# EAGLE design Adafruit 3.5in 480x320 FeatherWing Capacitive (EAGLE 9.6.2)
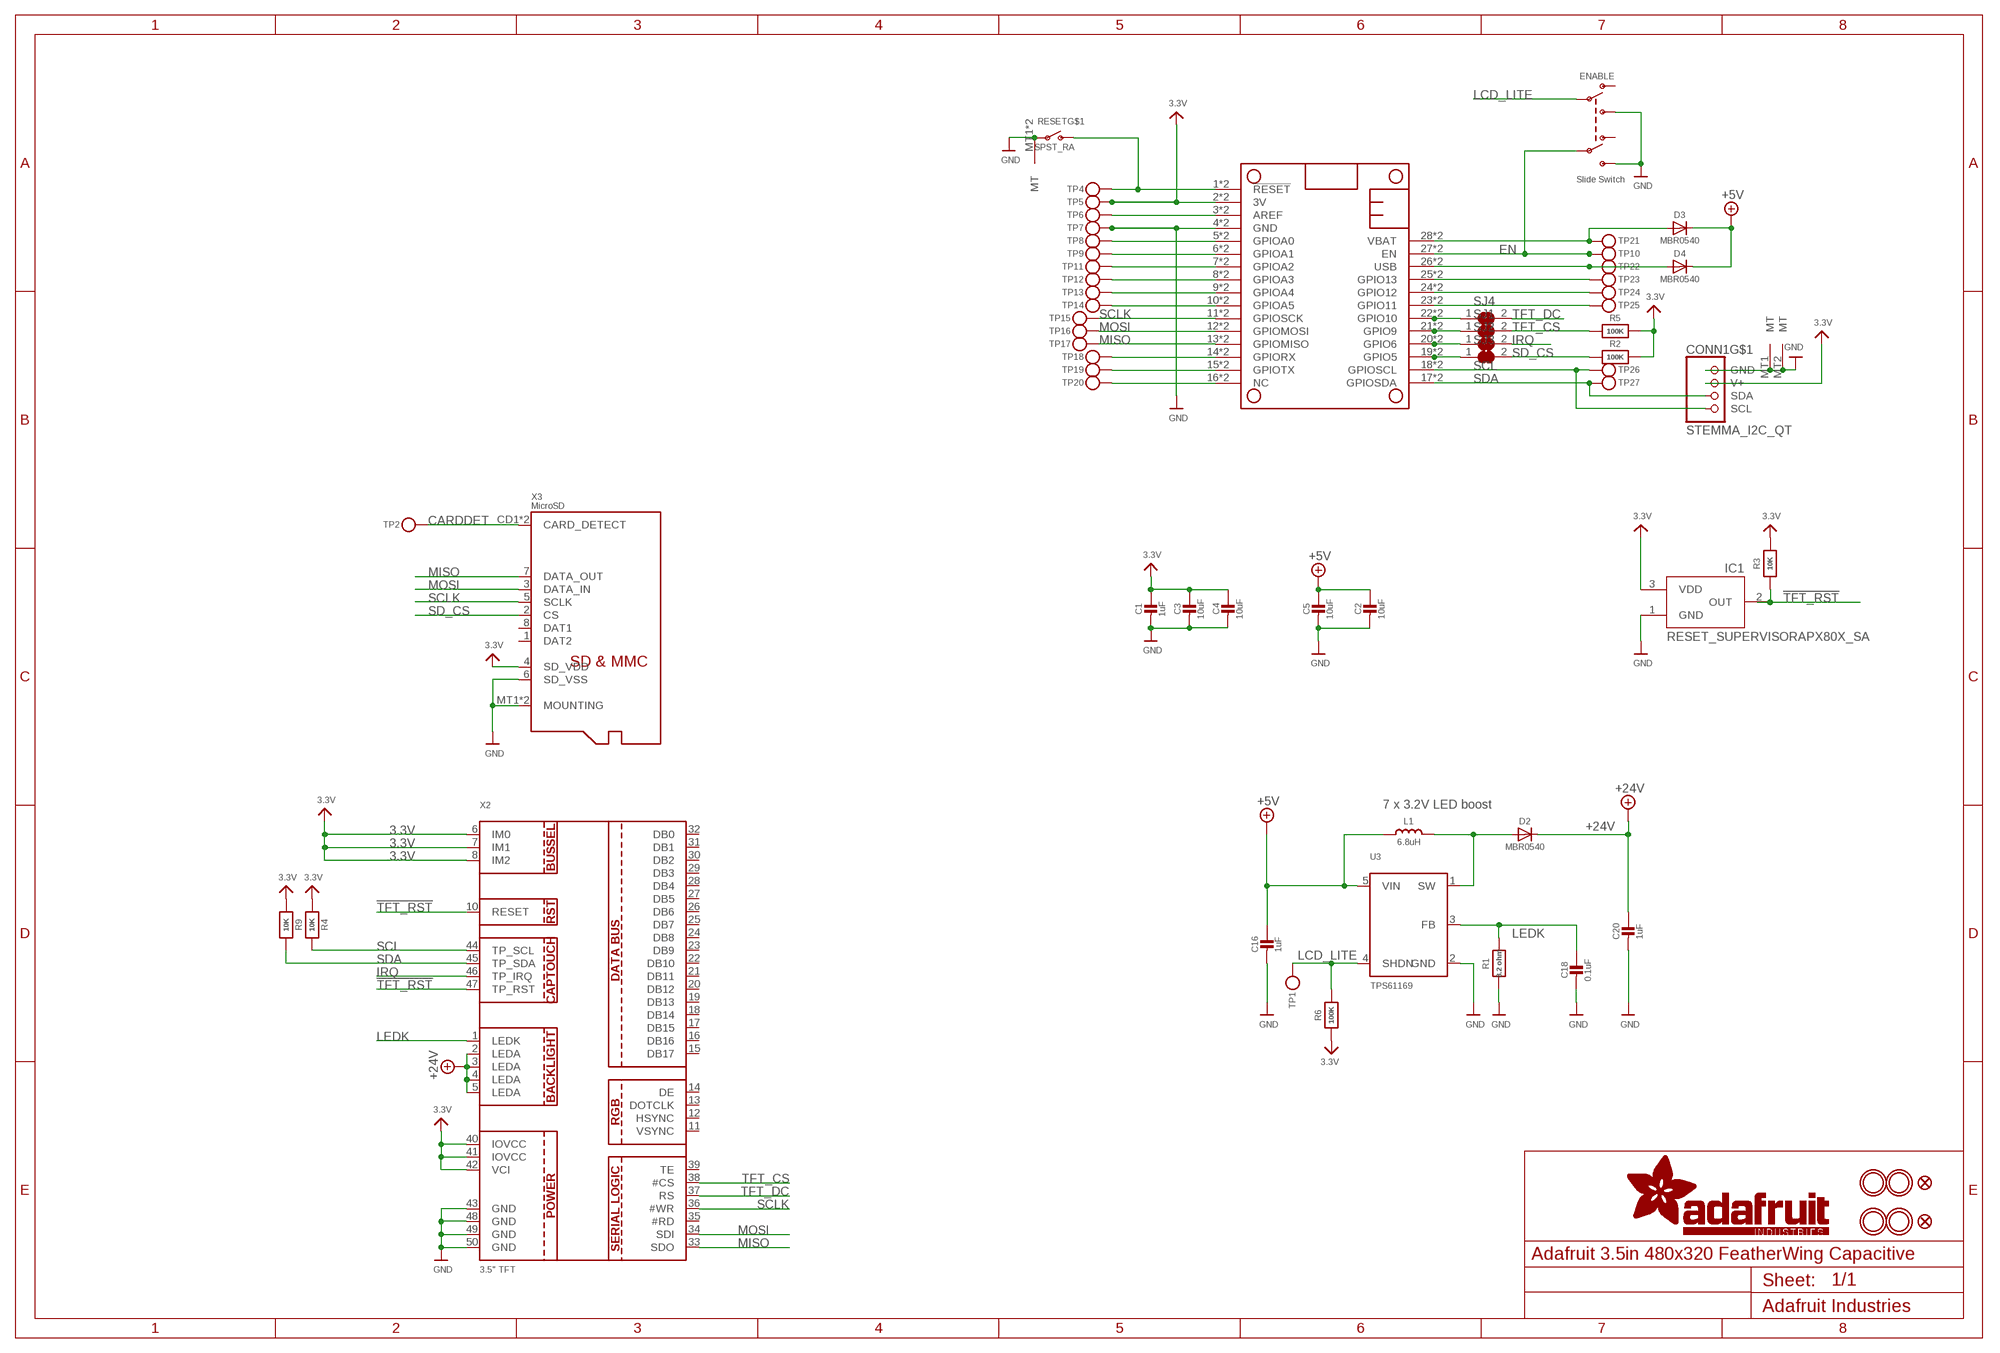
[diagram p0: schematic, sheet 1]

## Parts
C1  1uF  CAP_CERAMIC0805-NOOUTLINE  [0805-NO]
C2  10uF  CAP_CERAMIC0805-NOOUTLINE  [0805-NO]
C3  10uF  CAP_CERAMIC0805-NOOUTLINE  [0805-NO]
C4  10uF  CAP_CERAMIC0805-NOOUTLINE  [0805-NO]
C5  10uF  CAP_CERAMIC0805-NOOUTLINE  [0805-NO]
C16  1uF  CAP_CERAMIC0805-NOOUTLINE  [0805-NO]
C18  0.1uF  CAP_CERAMIC0603_NO  [0603-NO]
C20  1uF  CAP_CERAMIC0805-NOOUTLINE  [0805-NO]
CONN1  STEMMA_I2C_QT  [JST_SH4]
D2  MBR0540  DIODESOD-123  [SOD-123]
D3  MBR0540  DIODESOD-123  [SOD-123]
D4  MBR0540  DIODESOD-123  [SOD-123]
ENABLE  Slide Switch  SWITCH_DPDTEG1390  [EG1390]
IC1  RESET_SUPERVISORAPX80X_SA  [SOT23-WIDE]
L1  6.8uH  INDUCTORNR5040  [INDUCTOR_5X5MM_NR5040_NOTHERMALS]
MS2  FEATHERWING_SMTDUAL  [FEATHERWING_SMT2]
R1  8.2 ohm  RESISTOR_0603_NOOUT  [0603-NO]
R2  100K  RESISTOR_0603_NOOUT  [0603-NO]
R3  10K  RESISTOR_0603_NOOUT  [0603-NO]
R4  10K  RESISTOR_0603_NOOUT  [0603-NO]
R5  100K  RESISTOR_0603_NOOUT  [0603-NO]
R6  100K  RESISTOR_0603_NOOUT  [0603-NO]
R9  10K  RESISTOR_0603_NOOUT  [0603-NO]
RESET  SPST_RA  SWITCH_SPST_MNT_TACT_RA  [SPST_TACTILE_RA]
SJ1  SOLDERJUMPER_CLOSED  [SOLDERJUMPER_CLOSEDWIRE]
SJ2  SOLDERJUMPER_CLOSED  [SOLDERJUMPER_CLOSEDWIRE]
SJ3  SOLDERJUMPER_CLOSED  [SOLDERJUMPER_CLOSEDWIRE]
SJ4  SOLDERJUMPER_CLOSED  [SOLDERJUMPER_CLOSEDWIRE]
TP1  TESTPOINTPAD2MM  [TESTPOINT_PAD_2MM]
TP2  TESTPOINTPAD2MM  [TESTPOINT_PAD_2MM]
TP4  TESTPOINTPAD2MM  [TESTPOINT_PAD_2MM]
TP5  TESTPOINTPAD2MM  [TESTPOINT_PAD_2MM]
TP6  TESTPOINTPAD2MM  [TESTPOINT_PAD_2MM]
TP7  TESTPOINTPAD2MM  [TESTPOINT_PAD_2MM]
TP8  TESTPOINTPAD2MM  [TESTPOINT_PAD_2MM]
TP9  TESTPOINTPAD2MM  [TESTPOINT_PAD_2MM]
TP10  TESTPOINTPAD2MM  [TESTPOINT_PAD_2MM]
TP11  TESTPOINTPAD2MM  [TESTPOINT_PAD_2MM]
TP12  TESTPOINTPAD2MM  [TESTPOINT_PAD_2MM]
TP13  TESTPOINTPAD2MM  [TESTPOINT_PAD_2MM]
TP14  TESTPOINTPAD2MM  [TESTPOINT_PAD_2MM]
TP15  TESTPOINTPAD2MM  [TESTPOINT_PAD_2MM]
TP16  TESTPOINTPAD2MM  [TESTPOINT_PAD_2MM]
TP17  TESTPOINTPAD2MM  [TESTPOINT_PAD_2MM]
TP18  TESTPOINTPAD2MM  [TESTPOINT_PAD_2MM]
TP19  TESTPOINTPAD2MM  [TESTPOINT_PAD_2MM]
TP20  TESTPOINTPAD2MM  [TESTPOINT_PAD_2MM]
TP21  TESTPOINTPAD2MM  [TESTPOINT_PAD_2MM]
TP22  TESTPOINTPAD2MM  [TESTPOINT_PAD_2MM]
TP23  TESTPOINTPAD2MM  [TESTPOINT_PAD_2MM]
TP24  TESTPOINTPAD2MM  [TESTPOINT_PAD_2MM]
TP25  TESTPOINTPAD2MM  [TESTPOINT_PAD_2MM]
TP26  TESTPOINTPAD2MM  [TESTPOINT_PAD_2MM]
TP27  TESTPOINTPAD2MM  [TESTPOINT_PAD_2MM]
U3  TPS61169  VREG_BOOST_5PIN_SC70  [SC70-5]
U$7  MOUNTINGHOLE3.0THIN  [MOUNTINGHOLE_3.0_PLATEDTHIN]
U$9  FIDUCIAL_1MM  [FIDUCIAL_1MM]
U$15  MOUNTINGHOLE3.0THIN  [MOUNTINGHOLE_3.0_PLATEDTHIN]
U$16  MOUNTINGHOLE3.0THIN  [MOUNTINGHOLE_3.0_PLATEDTHIN]
U$17  MOUNTINGHOLE3.0THIN  [MOUNTINGHOLE_3.0_PLATEDTHIN]
U$23  FIDUCIAL_1MM  [FIDUCIAL_1MM]
X2  3.5" TFT  DISP_LCD_3.5IN_320X480CTP_50PIN  [TFT_3.5IN_320X480_50PIN]
X3  MicroSD  MICROSD  [MICROSD]

## Nets
3.3V: C1.1 C3.1 C4.1 CONN1.2(V+) IC1.3(VDD) MS2.2'(3V) MS2.2(3V) R2.2 R3.2 R4.1 R5.2 R6.1 R9.1 TP5.P$1 X2.6(IM0) X2.7(IM1) X2.8(IM2) X2.40(IOVCC) X2.41(IOVCC) X2.42(VCI) X3.4(SD_VDD)
!RESET: MS2.1'(!RESET) MS2.1(!RESET) RESET.2(S) TP4.P$1
!TFT_RST: IC1.2(OUT) R3.1 X2.10(RESET) X2.47(TP_RST)
+5V: C2.1 C5.1 C16.1 D3.C D4.C L1.P$1 U3.5(VIN)
+24V: C20.1 D2.C X2.2(LEDA) X2.3(LEDA) X2.4(LEDA) X2.5(LEDA)
A: MS2.5'(GPIOA0) MS2.5(GPIOA0) TP8.P$1
AREF: MS2.3'(AREF) MS2.3(AREF) TP6.P$1
B: MS2.6'(GPIOA1) MS2.6(GPIOA1) TP9.P$1
C: MS2.7'(GPIOA2) MS2.7(GPIOA2) TP11.P$1
CARDDET: TP2.P$1 X3.CD1(CARD_DETECT) X3.CD2(CARD_DETECT)
D: MS2.8'(GPIOA3) MS2.8(GPIOA3) TP12.P$1
E: MS2.9'(GPIOA4) MS2.9(GPIOA4) TP13.P$1
EN: ENABLE.P2 MS2.27'(EN) MS2.27(EN) TP10.P$1
F: MS2.10'(GPIOA5) MS2.10(GPIOA5) TP14.P$1
G: MS2.16'(NC) MS2.16(NC) TP20.P$1
GND: C1.2 C2.2 C3.2 C4.2 C5.2 C16.2 C18.2 C20.2 CONN1.1(GND) CONN1.MT1(MT) CONN1.MT2(MT) ENABLE.S1 ENABLE.S2 IC1.1(GND) MS2.4'(GND) MS2.4(GND) R1.1 RESET.1(P) RESET.MT1(MT) RESET.MT2(MT) TP7.P$1 U3.2(GND) X2.43(GND) X2.48(GND) X2.49(GND) X2.50(GND) X3.6(SD_VSS) X3.MT1(MOUNTING) X3.MT2(MOUNTING)
H: MS2.19'(GPIO5) MS2.19(GPIO5) SJ3.1
I: MS2.20'(GPIO6) MS2.20(GPIO6) SJ2.1
IRQ: SJ2.2 X2.46(TP_IRQ)
J: MS2.21'(GPIO9) MS2.21(GPIO9) SJ1.1
K: MS2.22'(GPIO10) MS2.22(GPIO10) SJ4.1
L: MS2.23'(GPIO11) MS2.23(GPIO11) TP25.P$1
LCD_LITE: ENABLE.P1 R6.2 TP1.P$1 U3.4(SHDN)
LEDK: C18.1 R1.2 U3.3(FB) X2.1(LEDK)
M: MS2.24'(GPIO12) MS2.24(GPIO12) TP24.P$1
MISO: MS2.13'(GPIOMISO) MS2.13(GPIOMISO) TP17.P$1 X2.33(SDO) X3.7(DATA_OUT)
MOSI: MS2.12'(GPIOMOSI) MS2.12(GPIOMOSI) TP16.P$1 X2.34(SDI) X3.3(DATA_IN)
N: MS2.25'(GPIO13) MS2.25(GPIO13) TP23.P$1
N$3: D2.A L1.P$2 U3.1(SW)
RX: MS2.14'(GPIORX) MS2.14(GPIORX) TP18.P$1
SCL: CONN1.4(SCL) MS2.18'(GPIOSCL) MS2.18(GPIOSCL) R4.2 TP26.P$1 X2.44(TP_SCL)
SCLK: MS2.11'(GPIOSCK) MS2.11(GPIOSCK) TP15.P$1 X2.36(#WR) X3.5(SCLK)
SD_CS: R2.1 SJ3.2 X3.2(CS)
SDA: CONN1.3(SDA) MS2.17'(GPIOSDA) MS2.17(GPIOSDA) R9.2 TP27.P$1 X2.45(TP_SDA)
TFT_CS: R5.1 SJ1.2 X2.38(#CS)
TFT_DC: SJ4.2 X2.37(RS)
TX: MS2.15'(GPIOTX) MS2.15(GPIOTX) TP19.P$1
USB: D4.A MS2.26'(USB) MS2.26(USB) TP22.P$1
VBAT: D3.A MS2.28'(VBAT) MS2.28(VBAT) TP21.P$1
Unconnected: ENABLE.O1 ENABLE.O2 X2.11(VSYNC) X2.12(HSYNC) X2.13(DOTCLK) X2.14(DE) X2.15(DB17) X2.16(DB16) X2.17(DB15) X2.18(DB14) X2.19(DB13) X2.20(DB12) X2.21(DB11) X2.22(DB10) X2.23(DB9) X2.24(DB8) X2.25(DB7) X2.26(DB6) X2.27(DB5) X2.28(DB4) X2.29(DB3) X2.30(DB2) X2.31(DB1) X2.32(DB0) X2.35(#RD) X2.39(TE) X3.1(DAT2) X3.8(DAT1)

## Notes on the sheet
- 7 x 3.2V LED boost

## Library data of the parts
C1-C5 C16 C18 C20 = microbuilder:CAP_CERAMIC: Ceramic Capacitors For new designs, use the packages preceded by an '_' character since they are more reliable: The following footprints should be used on most boards: _0402 - Standard footprint for regular board layouts _0603 - Standard footprint for regular board layouts _0805 - Standard footprint for regular board layouts _1206 - Standard footprint for regular board layouts For extremely tight-pitch boards where space is at a premium, the following 'micro-pitch' footprints can be used (smaller pads, no silkscreen outline, etc.): _0402MP - Micro-pitch footprint for very dense/compact boards _0603MP - Micro-pitch footprint for very dense/compact boards _0805MP - Micro-pitch footprint for very dense/compact boards _1206MP - Micro-pitch footprint for very dense/compact boards
CONN1 = adafruit_electromech:STEMMA_I2C; LCSC: C2845363
D2-D4 = microbuilder:DIODE: Diode SMA Model Volts Amps Type Vf Ir Digikey # Notes SSA34-E3 40V 3A Schottky 480mV @ 3A 200uA @ 40V SSA34-E3/61TGITR-ND CDBA120-G 20V 1A Schottky 500mV @ 1A 500uA @ 20V 641-1014-6-ND REEL MBRA210 10V 2A Schottky 350mV @ 2A 700uA @ 10V MBRA210LT3 SOD-123 Model Volts Amps Type Vf Ir Order # Notes BAT54T1G 30V 200mA Schottky 800mV @ 200mA 2uA @ 25V BAT54T1GOSTR-ND B0530W 30V 500mA Schottky 430mV @ 500mA 130uA @ 30V B0530W-FDICT-ND REEL MBR120 20V 1A Schottky 340mV @ 1A MBR120VLSFT1GOSCT-ND SOD-323 Model Volts Amps Type Vf Ir Order # Notes PMEG2005EJ 20V 500mA Schottky 355mV @ 500mA 568-4110-1-ND ZLLS410 10V 570mA Schottky 380mV @ 570mA ZLLS410CT-ND 1N4148WS 75V 150mA Silicon/Simple 1V 1N4148WSFSCT-ND REEL SOD-523 Model Volts Amps Type Vf Ir Order # Notes BAT54XV2 30V 200mA Schottky 0.8V @ 100mA BAT54XV2CT-ND TB751S 30V 30mA Schottky RB751S-40TE61CT-ND SOT23-R/W (R = Solder Paste/Reflow Ovens, W = Hand-Soldering) Model Volts Amps Type Vf Ir Order # Notes BAT54FILM 40V 300mA Schottky 497-7162-1-ND POWERDI-5 Model Volts Amps Type Vf Ir Order # Notes PDS560 60V 5A Schottky 670mV @ 5A 150uA @ 60V PDS560DICT-ND
ENABLE = adafruit_electromech:SWITCH_DPDT: Switch - DPDT A DPDT Switch acts like an SPDT switch, but has a pair of switches instead of just one. Vertical - 0.3A @ 6V SMT - Digikey: JS202011SCQN; LCSC: C2837066
IC1 = adafruit_power:RESET_SUPERVISOR; ROT: 270
L1 = microbuilder:INDUCTOR: Inductors 0603: 10nH Ceramic Inductor - microwire antenna/RF (Digikey: 712-1434-2-ND) 0805: 560nH Ceramic Inductor - RF (Digikey: 553-1047-1-ND) 270nH Ceramic Inductor - Q = 40@250MHz, +-5%, 1 Ohm DC Resistance (Digikey: 535-10506-2-ND) 1007 (2518 Metric) SMT: 10µH 10% 250mOhm 820mA 1007 Inductor (Digikey: 587-2189-1-ND) 22µH 10% 500mOhm 580mA 1007 Inductor (Digikey: 587-2190-1-ND) 47µH 10% 950mOhm 420mA 1007 Inductor (Digikey: 587-2191-1-ND) 47µH 5% 100mOhm 1A 1008 Inductor (Digikey: 732-1816-1-ND) 5.0x5.0mm (Taiyo Yuden NR5040 Series) 6.8µH 20% 2.3A 64mOhm Inductor (Digikey: 587-2374-2-ND) 5.0x5.0mm (TDK VLC5045 Series) 4.7µH 20% 3.3A 34mOhm Inductor (Digikey: 445-6526-1-ND) 6.8µH 20% 2.7A 46mOhm Inductor (Digikey: 445-6527-1-ND) 6.0x6.0mm (TDK VLC6045 Series) 4.7µH 20% 3.8A 27mOhm Inductor (Digikey: 445-6538-2-ND) 6.8µH 20% 3A 41mOhm Inductor (Digikey: 445-6540-1-ND) 6.2µH 30% 2.2A 45mOhm Inductor (Digikey: SRR5028-6R2YCT-ND) - Not TDK VLC6045 but footprint should match 6.0x6.0mm (TDK SLF6045 Series) 6.8uH 30% 2A 33mOhm Inductor (Digikey: 445-4572-1-ND, Mouser: 810-SLF645T6R8N2R0PF) 6.0x6.0mm (Sumida CDRH5D28 Series) 6.2uH 30% 1.8A 45mOhm Inductor (Digikey: 308-1542-1-ND) Taiyo Yuden NR3015T2R2M - 2.2uH 20% 1.5A (Digikey: 587-1648-2-ND, Mouser: 963-NR3015T2R2M) - Used with TI TPS62172 CoilCraft RFID Transponder Coil - MA5532-AE (For use with AS3935 Lightning Sensor) Taiyo Yuden NRH2412T2R2MNGH - 2.2uH 20% 1AA (Digikey: 587-3443-1-ND) - Used with TI LM3671 Vishay IHLP 1.0uH Molded Inductor - 24mOhm DCR, 5A, +/-20%, -55°C-125°C (Digikey: 541-1319-1-ND)
MS2 = microbuilder:FEATHERWING
R1-R6 R9 = microbuilder:RESISTOR: Resistors For new designs, use the packages preceded by an '_' character since they are more reliable: The following footprints should be used on most boards: _0402 - Standard footprint for regular board layouts _0603 - Standard footprint for regular board layouts _0805 - Standard footprint for regular board layouts _1206 - Standard footprint for regular board layouts For extremely tight-pitch boards where space is at a premium, the following 'micro-pitch' footprints can be used (smaller pads, no silkscreen outline, etc.): _0402MP - Micro-pitch footprint for very dense/compact boards _0603MP - Micro-pitch footprint for very dense/compact boards _0805MP - Micro-pitch footprint for very dense/compact boards _1206MP - Micro-pitch footprint for very dense/compact boards
RESET = adafruit_electromech:SWITCH_SPST_MNT: Switch - SPST 4UCon 19192 (6.7x2.6mm SMT); LCSC: C778159
SJ1-SJ4 = microbuilder:SOLDERJUMPER_CLOSED: Solder Jumper - Closed These solder jumpers are closed by default CLOSEDWIRE - 10 mil trace between pads that can be cut and resoldered later CLOSEDPERM - 63 mil trace between pads for a permanent connection (used to 'bridge' two signals, a shameless hack for Eagle). Can double as a test point as well (no cream layer)
TP1 TP2 TP4-TP27 = microbuilder:TESTPOINT: Test Point Various test points for characterisation and PCB testing TESTPOINT_SMT - Compact Surface Mount Test Point [Digikey: 5016KTR-ND]
U3 = adafruit_power:VREG_BOOST_5PIN: FAN5331 - LED/OLED 20V Boost Converter Digikey: FAN5331SXCT-ND
U$7 U$15-U$17 = adafruit_electromech:MOUNTINGHOLE: Mounting Hole For #2 screws (0.086"/2.18mm width, 0.094"/2.4mm hole) use 2.5mm; BOM: EXCLUDE
U$9 U$23 = microbuilder:FIDUCIAL: Fiducial Alignment Points Various fiducial points for machine vision alignment.; BOM: EXCLUDE
X2 = adafruit_display:DISP_LCD_3.5IN_320X480CTP_50PIN
X3 = adafruit_electromech:MICROSD: MicroSD/Transflash Card Holder with SPI pinout 3M: 2908-05WB-MG 4UConnector: 19656 Footprint courtesy: Adafruit Industries; JLC_ROTATION: 90; LCSC: C125617

## Board
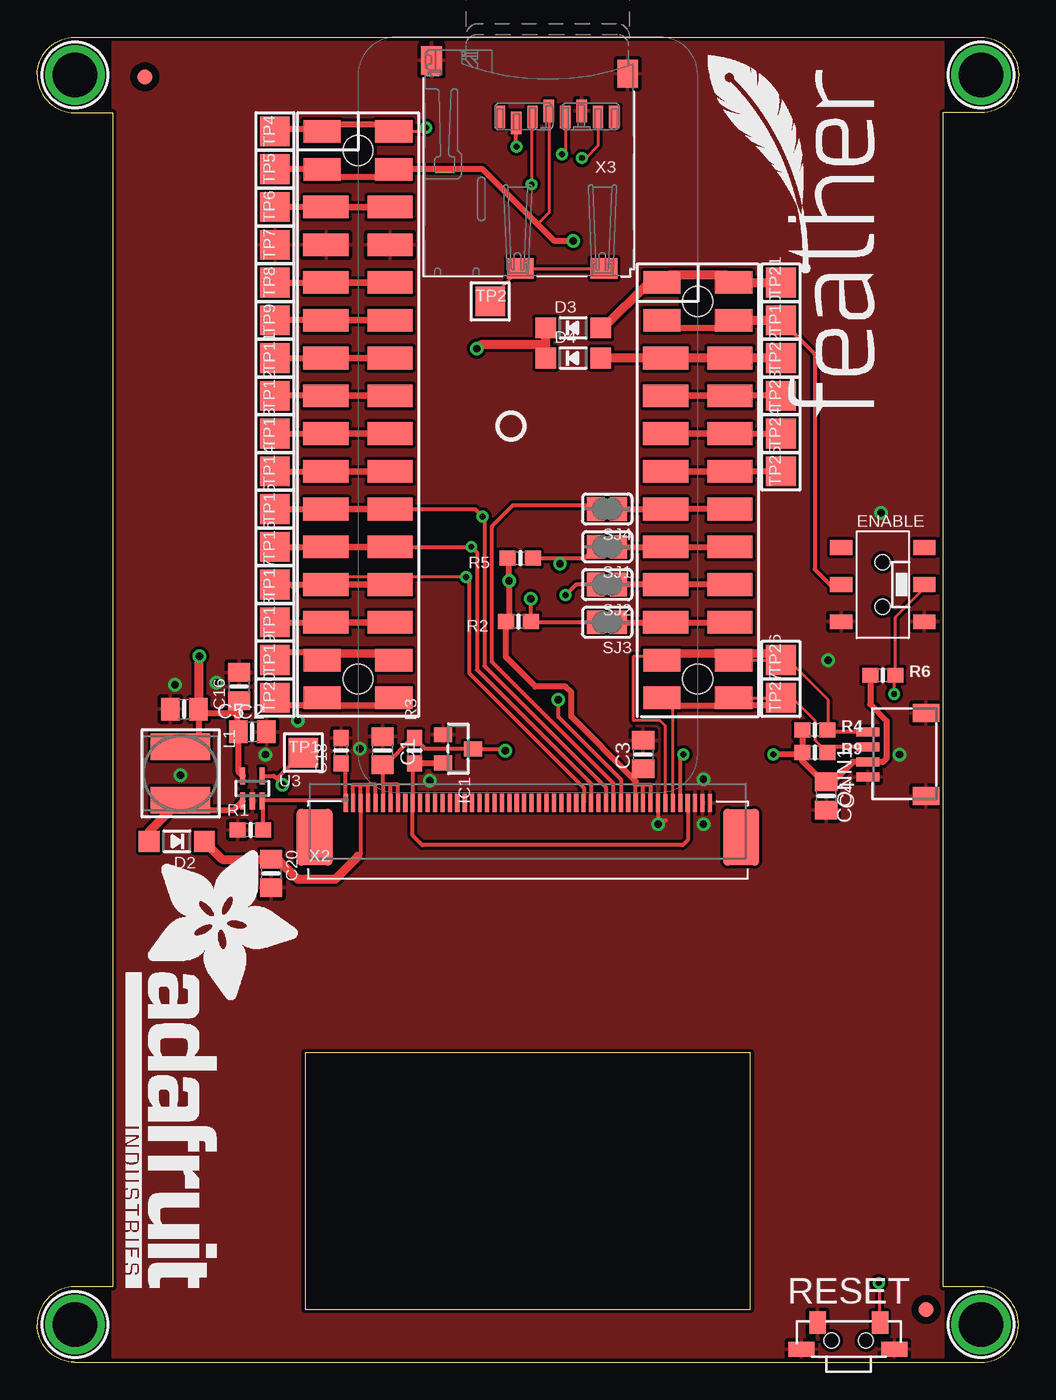
[diagram p1: board, top side]
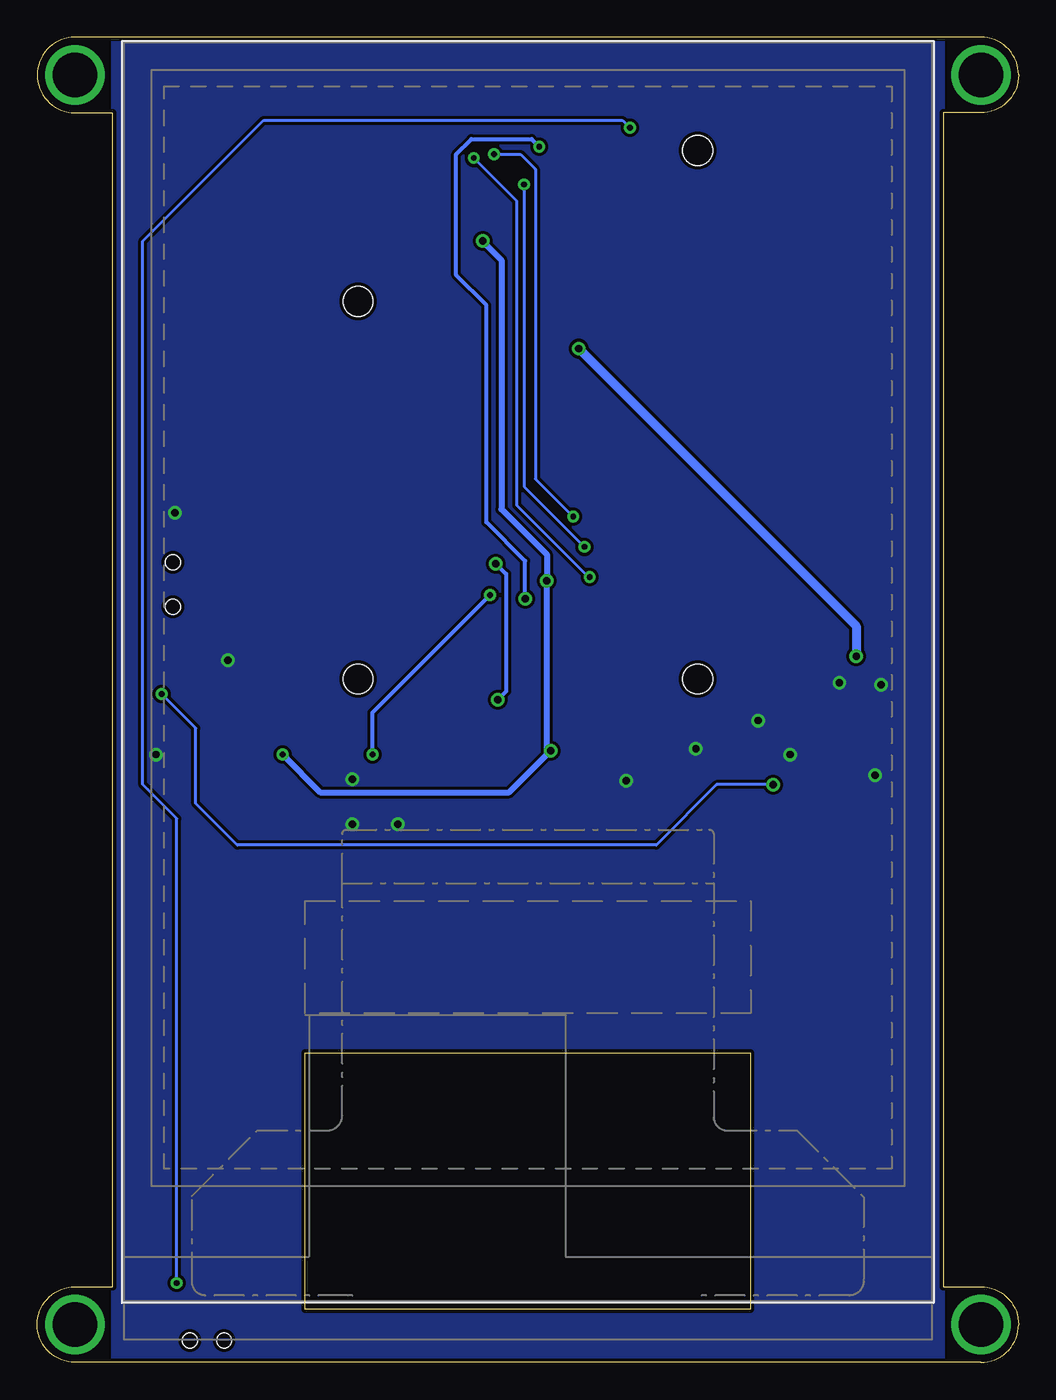
[diagram p2: board, bottom side, seen from below]

Size 66.04 x 89.15 mm. Coordinates in mm from the lower left corner, seen from the top.
Outline: 2.54,0 63.5,0 arc90 66.04,2.54 arc90 63.5,5.08 60.96,5.08 60.96,84.07 63.5,84.07 arc90 66.04,86.61 arc90 63.5,89.15 2.54,89.15 arc90 0,86.61 arc90 2.54,84.07 5.08,84.07 5.08,5.08 2.54,5.08 arc90 0,2.54 arc90 2.54,0
Outline: 18.03,20.83 18.03,3.56 48.01,3.56 48.01,20.83 18.03,20.83
Copper layers (1*16): Top 0.035mm / dielectric 1.5mm / Bottom 0.035mm
Design rules "adafruit *": minimum track width 8mil, minimum drill 15.5mil, track to track 8mil, track to pad 8mil, pad to pad 8mil, via to via 8mil, smd to smd 8mil, copper to edge 10mil, drill to drill 8mil, minimum pad ring 10mil, minimum via ring 8mil, stop-mask expansion 2mil, vias tented up to drill 20mil, thermal gap 10mil
tRestrict: area 44.5,37.5 to 44.6,37.8; area 45,37.5 to 45.1,37.8

### Footprints (pad centres in the part's own frame; a part is rotated, then mirrored left to right if it is on the bottom)
0805-NO = smd 1.24 x 1.5: 1 -0.95,0; 2 0.95,0
0603-NO = smd 1.075 x 1: 1 -0.85,0; 2 0.85,0
JST_SH4 = smd 0.6 x 1.55: 1 -1.5,2.006; 2 -0.5,2.006; 3 0.5,2.006; 4 1.5,2.006 | smd 1.2 x 1.8: MT1 -2.8,-1.894; MT2 2.8,-1.894
SOD-123 = smd 1.4 x 1.4: A 1.85,0; C -1.85,0
EG1390 = smd 1 x 1.5: O1 -2.5,2.8; O2 -2.5,-2.8; P1 0,2.8; P2 0,-2.8; S1 2.5,2.8; S2 2.5,-2.8 | hole 1: 1.5,0; -1.5,0
SOT23-WIDE = smd 1 x 1.2: 1 -0.95,-1; 2 0.95,-1; 3 0,1
INDUCTOR_5X5MM_NR5040_NOTHERMALS = smd 1.8 x 4: P$1 -1.8,0; P$2 1.8,0
FEATHERWING_SMT2 = smd 1.524 x 2.5: 1 6.35,2.413; 1' 6.35,-2.413; 2 8.89,2.413; 2' 8.89,-2.413; 15 41.91,2.413; 15' 41.91,-2.413; 16 44.45,2.413; 16' 44.45,-2.413; 17 44.45,20.447; 17' 44.45,25.273; 18 41.91,20.447; 18' 41.91,25.273; 27 19.05,20.447; 27' 19.05,25.273; 28 16.51,20.447; 28' 16.51,25.273 | smd 1.524 x 3.048: 3 11.43,2.159; 3' 11.43,-2.159; 4 13.97,2.159; 4' 13.97,-2.159; 5 16.51,2.159; 5' 16.51,-2.159; 6 19.05,2.159; 6' 19.05,-2.159; 7 21.59,2.159; 7' 21.59,-2.159; 8 24.13,2.159; 8' 24.13,-2.159; 9 26.67,2.159; 9' 26.67,-2.159; 10 29.21,2.159; 10' 29.21,-2.159; 11 31.75,2.159; 11' 31.75,-2.159; 12 34.29,2.159; 12' 34.29,-2.159; 13 36.83,2.159; 13' 36.83,-2.159; 14 39.37,2.159; 14' 39.37,-2.159; 19 39.37,20.701; 19' 39.37,25.019; 20 36.83,20.701; 20' 36.83,25.019; 21 34.29,20.701; 21' 34.29,25.019; 22 31.75,20.701; 22' 31.75,25.019; 23 29.21,20.701; 23' 29.21,25.019; 24 26.67,20.701; 24' 26.67,25.019; 25 24.13,20.701; 25' 24.13,25.019; 26 21.59,20.701; 26' 21.59,25.019 | hole 2: 17.78,22.86; 43.18,22.86; 7.62,0; 43.18,0
SPST_TACTILE_RA = smd 1.1 x 1.5: 1 2.1,-0.9; 2 -2.1,-0.9 | smd 1.75 x 1: MT1 3.175,0.9; MT2 -3.075,0.9 | hole 1: 1.15,0.3; -1.15,0.3
SOLDERJUMPER_CLOSEDWIRE = smd 1.168 x 1.6: 1 -0.762,0; 2 0.762,0 | smd 0.635 x 0.203: WIRE 0,0
TESTPOINT_PAD_2MM = smd 2 x 2: P$1 0,0
SC70-5 = smd 0.35 x 1.15: 1 -0.65,-0.85; 2 0,-0.85; 3 0.65,-0.85; 4 0.65,0.85; 5 -0.65,0.85
MOUNTINGHOLE_3.0_PLATEDTHIN = drill 3 pad 3.6: P$1 0,0
FIDUCIAL_1MM = smd 1 x 1: 1 0,0
TFT_3.5IN_320X480_50PIN = smd 0.275 x 1.2 bottom: 1 12.25,1.066; 2 11.75,1.066; 3 11.25,1.066; 4 10.75,1.066; 5 10.25,1.066; 6 9.75,1.066; 7 9.25,1.066; 8 8.75,1.066; 9 8.25,1.066; 10 7.75,1.066; 11 7.25,1.066; 12 6.75,1.066; 13 6.25,1.066; 14 5.75,1.066; 15 5.25,1.066; 16 4.75,1.066; 17 4.25,1.066; 18 3.75,1.066; 19 3.25,1.066; 20 2.75,1.066; 21 2.25,1.066; 22 1.75,1.066; 23 1.25,1.066; 24 0.75,1.066; 25 0.25,1.066; 26 -0.25,1.066; 27 -0.75,1.066; 28 -1.25,1.066; 29 -1.75,1.066; 30 -2.25,1.066; 31 -2.75,1.066; 32 -3.25,1.066; 33 -3.75,1.066; 34 -4.25,1.066; 35 -4.75,1.066; 36 -5.25,1.066; 37 -5.75,1.066; 38 -6.25,1.066; 39 -6.75,1.066; 40 -7.25,1.066; 41 -7.75,1.066; 42 -8.25,1.066; 43 -8.75,1.066; 44 -9.25,1.066; 45 -9.75,1.066; 46 -10.25,1.066; 47 -10.75,1.066; 48 -11.25,1.066; 49 -11.75,1.066; 50 -12.25,1.066 | smd 2.4 x 3.81 bottom: PAD1 14.35,-1.253; PAD2 -14.35,-1.253
MICROSD = smd 0.7 x 1.5: 1 1.761,-3.147; 2 0.661,-2.747; 3 -0.439,-3.147; 4 -1.539,-3.547; 5 -2.639,-3.147; 6 -3.739,-3.547; 7 -4.839,-3.147; 8 -5.939,-3.147 | smd 1.8 x 1.4: CD1 -5.239,7.053; CD2 0.38,7.053 | smd 1.4 x 1.9: MT1 -6.839,-6.047; MT2 6.361,-6.947

### Placement (x,y rotation side)
C1  23.24,41.15 90 top
C2  14.48,42.42 0 top
C3  40.77,40.89 90 top
C4  53.09,38.1 270 top
C5  9.91,43.94 180 top
C16  13.59,45.47 90 top
C18  20.45,41.15 90 top
C20  15.75,32.89 270 top
CONN1  57.91,40.89 90 top
D2  9.4,35.05 180 top
D3  36.07,69.6 0 top
D4  36.07,67.56 0 top
ENABLE  56.9,52.32 270 top
IC1  28.32,41.27 270 top
L1  9.65,39.62 270 top
MS2  21.59,89.15 270 top
PLABEL0  [PLABEL0]  57.28,56.64 0 top
PLABEL1  [PLABEL1]  56.52,47.12 0 top
PLABEL2  [PLABEL2]  52.2,3.94 0 top
PLABEL3  [PLABEL3]  52.58,48.77 90 top
PLABEL4  [PLABEL4]  17.27,38.35 0 top
PLABEL5  [PLABEL5]  36.45,57.4 0 top
PLABEL6  [PLABEL6]  36.45,54.86 0 top
PLABEL7  [PLABEL7]  36.45,52.45 0 top
PLABEL8  [PLABEL8]  36.45,49.78 0 top
PLABEL9  [PLABEL9]  8.64,59.56 90 top
PLABEL12  [PLABEL12]  36.45,71.63 0 top
PLABEL14  [PLABEL14]  42.93,80.52 90 top
PLABEL15  [PLABEL15]  59.94,30.23 90 top
PLABEL16  [PLABEL16]  13.72,49.15 90 top
R1  14.35,35.81 0 top
R2  32.39,49.85 180 top
R3  25.4,41.15 90 top
R4  52.32,42.55 0 top
R5  32.51,54.1 180 top
R6  56.9,46.23 0 top
R9  52.32,41.02 0 top
RESET  54.61,1.78 180 top
SJ1  38.35,54.86 180 top
SJ2  38.35,52.32 180 top
SJ3  38.35,49.78 180 top
SJ4  38.35,57.4 180 top
TP1  17.91,41.02 0 top
TP2  30.48,71.37 0 top
TP4  16,82.8 90 top
TP5  16,80.26 90 top
TP6  16,77.72 90 top
TP7  16,75.18 90 top
TP8  16,72.64 90 top
TP9  16,70.1 90 top
TP10  50.04,70.1 90 top
TP11  16,67.56 90 top
TP12  16,65.02 90 top
TP13  16,62.48 90 top
TP14  16,59.94 90 top
TP15  16,57.4 90 top
TP16  16,54.86 90 top
TP17  16,52.32 90 top
TP18  16,49.78 90 top
TP19  16,47.24 90 top
TP20  16,44.7 90 top
TP21  50.04,72.64 90 top
TP22  50.04,67.56 90 top
TP23  50.04,65.02 90 top
TP24  50.04,62.48 90 top
TP25  50.04,59.94 90 top
TP26  50.04,47.24 90 top
TP27  50.04,44.7 90 top
U3  14.48,38.61 0 top
U$7  2.54,2.54 0 top
U$9  59.82,3.56 0 top
U$11  [FEATHERLOGO]  56.39,63.63 90 top
U$15  63.5,2.54 0 top
U$16  2.54,86.61 0 top
U$17  63.5,86.61 0 top
U$19  [ADAFRUIT_TEXT_30MM]  5.97,34.67 270 top
U$23  7.24,86.49 0 top
U$37  [PCBFEAT-REV-040]  31.88,62.99 0 top
X2  33.02,36.58 0 bottom
X3  32.89,80.65 180 top

### Tracks (layer width: path | path; a pad name or v marks a point on that pad's centre or on a via)
3.3V  (via drill 0.39, 0.5)
  Top 0.203: C3.1 40.13,39.31 40.07,39.31 | X3.4 34.43,77.36 33.66,76.58
  Top 0.254: 23.77,38.86 23.27,38.86 | X2.8 24.27,38.86 23.77,38.86 | X2.7 23.77,38.86 | 23.27,38.86 23.27,40.2 C1.1 23.43,40.2 25.23,42 R3.2 26.12,41.27 IC1.3 31.37,41.27 v31.5,41.15 | 40.77,38.86 40.27,38.86 X2.40 | X2.42 41.27,38.86 40.77,38.86 | X2.41 40.77,38.86 | 23.27,38.86 X2.6
  Top 0.406: v36.07,75.44 34.8,75.44 33.66,76.58 29.97,80.26 MS2.2 23.88,80.26 23.37,79.76 19.69,79.76 MS2.2' TP5.P$1 | 40.27,38.86 40.27,39.11 40.07,39.31 35.94,43.43 35.94,45.09 35.56,45.47 33.53,45.47 31.54,47.46 R2.2 31.75,50.06 v31.75,52.58 31.75,54.01 R5.2 | R4.1 R9.1 | R9.1 51.47,40.47 52.9,39.05 C4.1 53.53,39.05 54.87,40.39 CONN1.2 56.9,40.39 57.15,40.64 57.15,43.18 56.05,44.28 R6.1 | R9.1 51.35,40.89 v49.53,40.89
  Bottom 0.254: v31.5,41.15 31.75,41.4
  Bottom 0.406: v36.07,75.44 34.8,74.17 34.8,57.4 31.75,54.36 v31.75,52.58 31.75,41.4 31.75,40.89 34.29,38.35 46.99,38.35 v49.53,40.89
!RESET  (via drill 0.39)
  Top 0.203: RESET.2 56.71,5.27 v56.64,5.33 | v26.16,83.06 25.91,82.8 MS2.1
  Top 0.406: MS2.1' 19.37,83 | 19.37,83 19.69,83.31 23.24,83.31 23.75,82.8 MS2.1 | TP4.P$1 16.19,83 19.37,83
  Bottom 0.203: v56.64,5.33 56.64,36.58 58.93,38.86 58.93,75.44 50.8,83.57 26.67,83.57 v26.16,83.06
!TFT_RST
  Top 0.254: 25.26,40.05 25.26,37.66 X2.10 25.27,35.44 25.91,34.8 43.43,34.8 43.77,35.13 X2.47
  Top 0.406: 25.26,40.05 25.4,40.2 R3.1 25.43,40.33 IC1.2
+5V  (via drill 0.5)
  Top 0.406: 13.46,43.63 13.46,43.69 10.86,43.69 C5.1 10.86,41.42 L1.P$1 | 13.46,43.63 13.46,42.42 C2.1 13.53,39.76 U3.5 | C16.1 13.59,43.75 13.46,43.63
  Top 0.61: 34.22,68.45 29.85,68.45 v29.59,68.2 | v10.92,47.5 10.86,47.43 C5.1 | D3.C 34.22,68.45 | D4.C 34.22,68.45
  Bottom 0.61: v29.59,68.2 10.92,49.53 v10.92,47.5
+24V
  Top 0.254: 21.77,38.86 21.27,38.86 X2.2 | 21.77,38.86 22.27,38.86 | X2.5 22.77,38.86 22.27,38.86 | X2.4 22.27,38.86 | 21.77,38.86 X2.3 21.77,34.22 21.59,34.04
  Top 0.61: D2.C 12.46,33.84 C20.1 16.2,33.84 17.53,32.51 20.07,32.51 21.59,34.04
A
  Top 0.406: TP8.P$1 MS2.5 MS2.5'
AREF
  Top 0.406: MS2.3' MS2.3 TP6.P$1
B
  Top 0.406: MS2.6' MS2.6 TP9.P$1
C
  Top 0.406: TP11.P$1 MS2.7 MS2.7'
CARDDET
  Top 0.203: X3.CD1 X3.CD2 30.04,71.12 29.97,71.12 30.23,71.37 TP2.P$1
D
  Top 0.406: MS2.8' MS2.8 TP12.P$1
E
  Top 0.406: TP13.P$1 MS2.9 MS2.9'
EN
  Top 0.254: TP10.P$1 52.32,67.82 52.32,53.34 53.34,52.32 ENABLE.P2
  Top 0.406: MS2.27 42.55,69.6 46.48,69.6 46.86,69.98 MS2.27'
  Top 0.61: MS2.27' TP10.P$1
F
  Top 0.406: TP14.P$1 MS2.10 MS2.10'
G
  Top 0.406: TP20.P$1 16.51,44.2 23.5,44.2 MS2.16 23.75,44.7 23.24,44.2 19.69,44.2 MS2.16'
GND  (via drill 0.5)
  Top 0.254: X2.43 41.77,36.46 42.28,36.46
  other vias: 44.83,36.2 17.53,43.18 21.72,41.27 9.65,39.5 15.37,40.89 9.27,45.59 12.07,45.72 26.42,39.12 44.83,39.24 53.21,47.24 56.77,57.15 58.04,40.89 41.78,36.2
  pour Top: 5.08,89.15 5.08,0 60.96,0 60.96,89.15
  pour Bottom: 5.08,89.15 5.08,0 60.96,0 60.96,89.15
H
  Top 0.406: SJ3.1 MS2.19 MS2.19'
I
  Top 0.406: MS2.20' MS2.20 SJ2.1
IRQ  (via drill 0.39)
  Top 0.254: SJ2.2 36.26,52.32 v35.56,51.62 | X2.46 43.27,40.69 v43.48,40.89
  Bottom 0.254: v43.48,40.89 43.48,43.71 v35.56,51.62
J
  Top 0.406: SJ1.1 MS2.21 MS2.21'
K
  Top 0.406: MS2.22' MS2.22 SJ4.1
L
  Top 0.406: TP25.P$1 41.4,59.94 41.4,60.2 42.29,60.2 MS2.23 MS2.23'
LCD_LITE  (via drill 0.39, 0.5)
  Top 0.203: ENABLE.P1 59.7,52.08 57.75,50.13 R6.2 57.66,46.14 v57.66,44.96
  Top 0.254: U3.4 15.91,39.46 16,39.37 | v16.51,38.86 16,39.37 | 16,39.37 16.26,39.37 TP1.P$1
  Bottom 0.203: v16.51,38.86 20.32,38.86 24.38,34.8 52.58,34.8 55.37,37.59 55.37,42.67 v57.66,44.96
LEDK
  Top 0.254: C18.1 20.45,40.07 20.71,39.8 20.71,37.7 X2.1 20.6,37.82 15.19,37.82 U3.3 15.2,37.69 R1.2
M
  Top 0.406: MS2.24' MS2.24 TP24.P$1
MISO  (via drill 0.39)
  Top 0.203: X3.7 37.73,81.84 36.92,81.03 v36.66,81.03 | v28.86,52.83 18.29,52.83 17.4,51.94
  Top 0.254: TP17.P$1 17.02,52.32 17.4,51.94 | X2.33 36.78,38.66 29.08,46.36 29.08,52.61 v28.86,52.83
  Top 0.406: TP17.P$1 MS2.13 MS2.13'
  Bottom 0.203: v36.66,81.03 33.78,78.15 33.78,57.66 28.96,52.83 v28.86,52.83
MOSI  (via drill 0.39)
  Top 0.203: X3.3 33.27,83.73 v33.27,79.25
  Top 0.254: TP16.P$1 v29.21,54.86 29.59,54.48 29.59,46.61 37.27,38.93 X2.34
  Top 0.406: TP16.P$1 MS2.12 MS2.12'
  Bottom 0.203: v33.27,79.25 33.27,58.93 v29.21,54.86
N
  Top 0.406: TP23.P$1 MS2.25 MS2.25'
N$3
  Top 0.406: L1.P$2 10.34,37.13 13.2,37.13 U3.1
  Top 0.61: L1.P$2 7.55,35.72 D2.A
RX
  Top 0.406: TP18.P$1 MS2.14 MS2.14'
SCL
  Top 0.203: X2.44 42.27,42.82 41.91,43.18 40.13,43.18 40.13,47.5 49.78,47.5 TP26.P$1 | MS2.18' 50.55,47.24 53.19,44.6 53.19,42.52
  Top 0.254: CONN1.4 53.33,42.39 53.19,42.52 R4.2
  Top 0.406: TP26.P$1 49.53,47.75 42.55,47.75 MS2.18 42.42,47.62 46.48,47.62 MS2.18'
SCLK  (via drill 0.39)
  Top 0.203: X3.5 35.56,83.76 35.56,81.53 v35.31,81.28
  Top 0.254: TP15.P$1 29.46,57.4 v29.97,56.9 30.1,56.77 30.1,46.86 38.27,38.69 X2.36
  Top 0.406: TP15.P$1 MS2.11 MS2.11'
  Bottom 0.203: v35.31,81.28 33.53,81.28 32.51,80.26 32.51,59.44 v29.97,56.9
SD_CS  (via drill 0.39, 0.5)
  Top 0.254: R2.1 33.21,49.87 v33.21,51.37 33.21,50.1 33.53,49.78 SJ3.2 | v32.26,81.79 32.23,81.81 X3.2
  Bottom 0.254: v33.21,51.37 33.21,53.91 35.81,56.52 35.81,71.12 37.85,73.15 37.85,81.28 36.83,82.3 32.77,82.3 v32.26,81.79
SDA
  Top 0.203: X2.45 42.77,43.97 42.48,44.26 | MS2.17' 50.8,44.7 52.32,43.19 52.32,41.88 R9.2
  Top 0.254: CONN1.3 53.55,41.39 R9.2
  Top 0.406: TP27.P$1 49.53,44.2 46.48,44.2 | MS2.17 42.48,44.26 42.55,44.2 46.48,44.2 | 46.48,44.2 46.86,44.58 MS2.17'
TFT_CS  (via drill 0.5)
  Top 0.254: v35.05,44.58 35.05,43.43 39.27,39.22 X2.38 | R5.1 35.56,54.1 | 35.56,54.1 36.83,54.1 SJ1.2 | 35.56,54.1 v35.18,53.72
  Bottom 0.254: v35.05,44.58 34.49,45.14 34.49,53.03 v35.18,53.72
TFT_DC
  Top 0.254: X2.37 38.77,38.95 30.61,47.12 30.61,56.26 32,57.66 37.34,57.66 SJ4.2
TX
  Top 0.406: TP19.P$1 16.51,47.75 23.5,47.75 MS2.15 23.75,47.24 23.37,47.62 19.56,47.62 MS2.15'
USB
  Top 0.406: MS2.26' MS2.26 TP22.P$1
  Top 0.61: TP22.P$1 D4.A
VBAT
  Top 0.61: D3.A 38.1,69.6 41.15,72.64 MS2.28 42.55,73.15 46.36,73.15 MS2.28' TP21.P$1

### Text on the board
Pinguin_tBackup: DC | TCS | IRQ | Capaciptive Touch | SCS | A1 | A0 | LITE | 3.5" 480x320 TFT / FeatherWing V2 | TSC2007 I2C 0x48 / Touch Controller | SDDET | Stemma / QT I2C | Enable | Reset | OFF | ON | MicroSD